# EasyEDA Pro project LEDChaser_PCB2_2025-11-05.epro

# Board PCB2
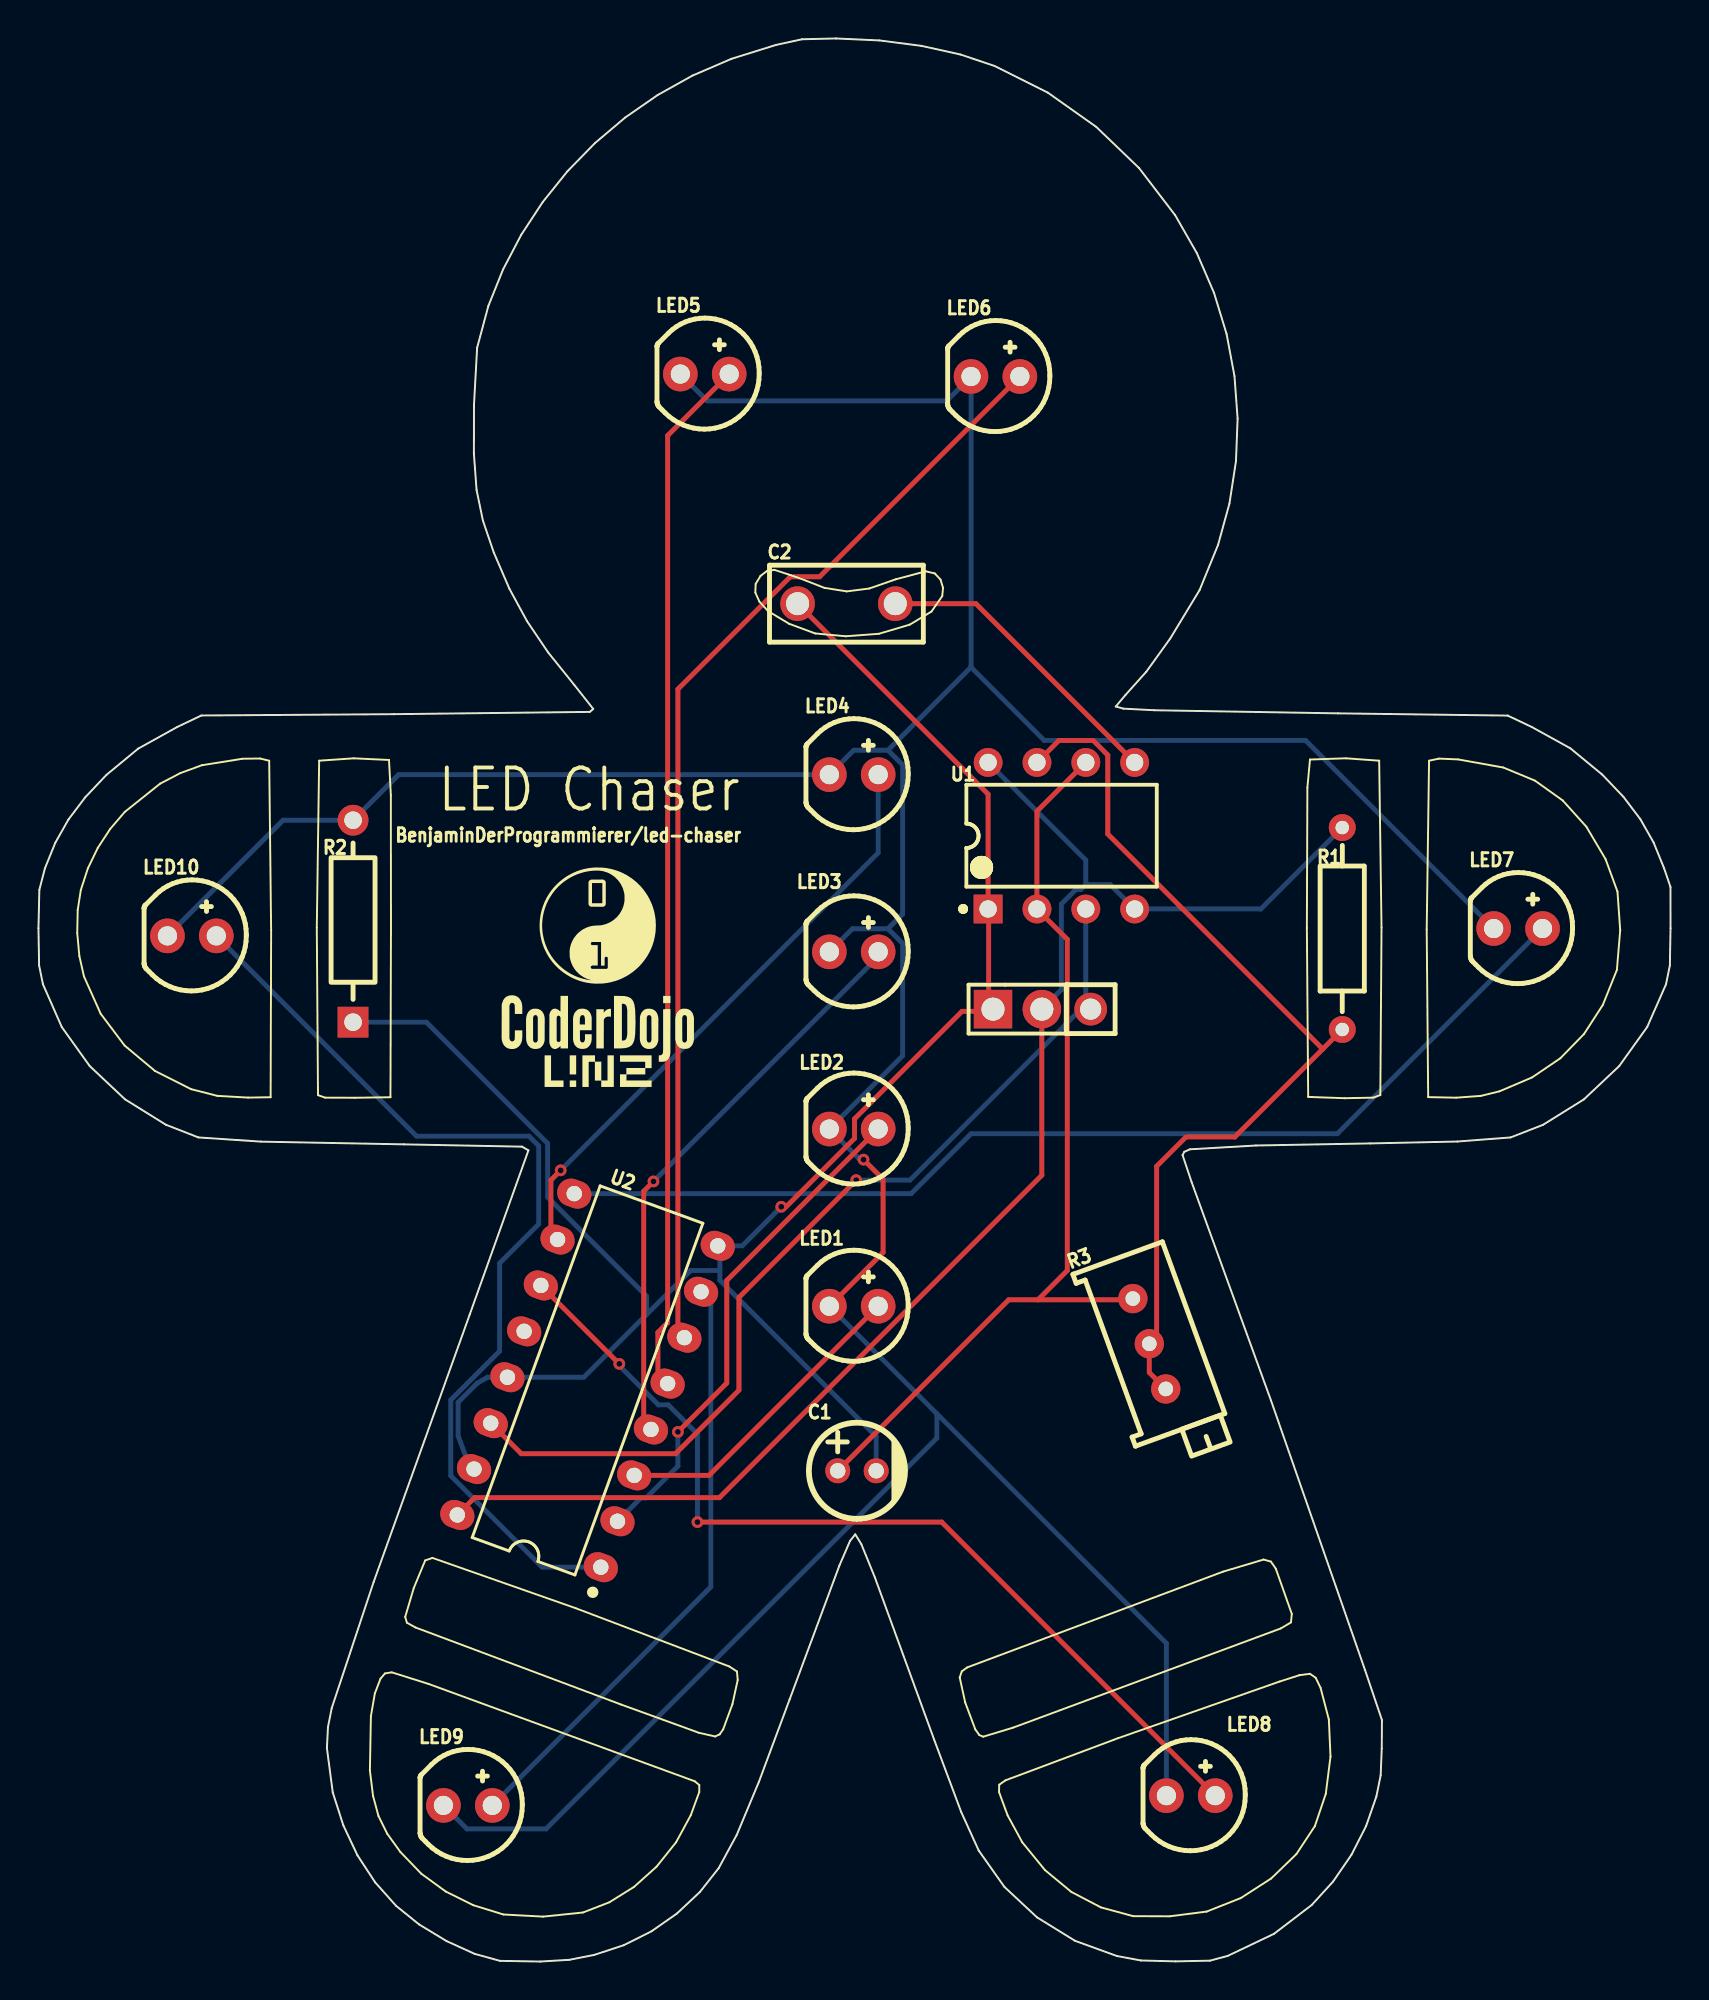
[diagram p0: board, top side]
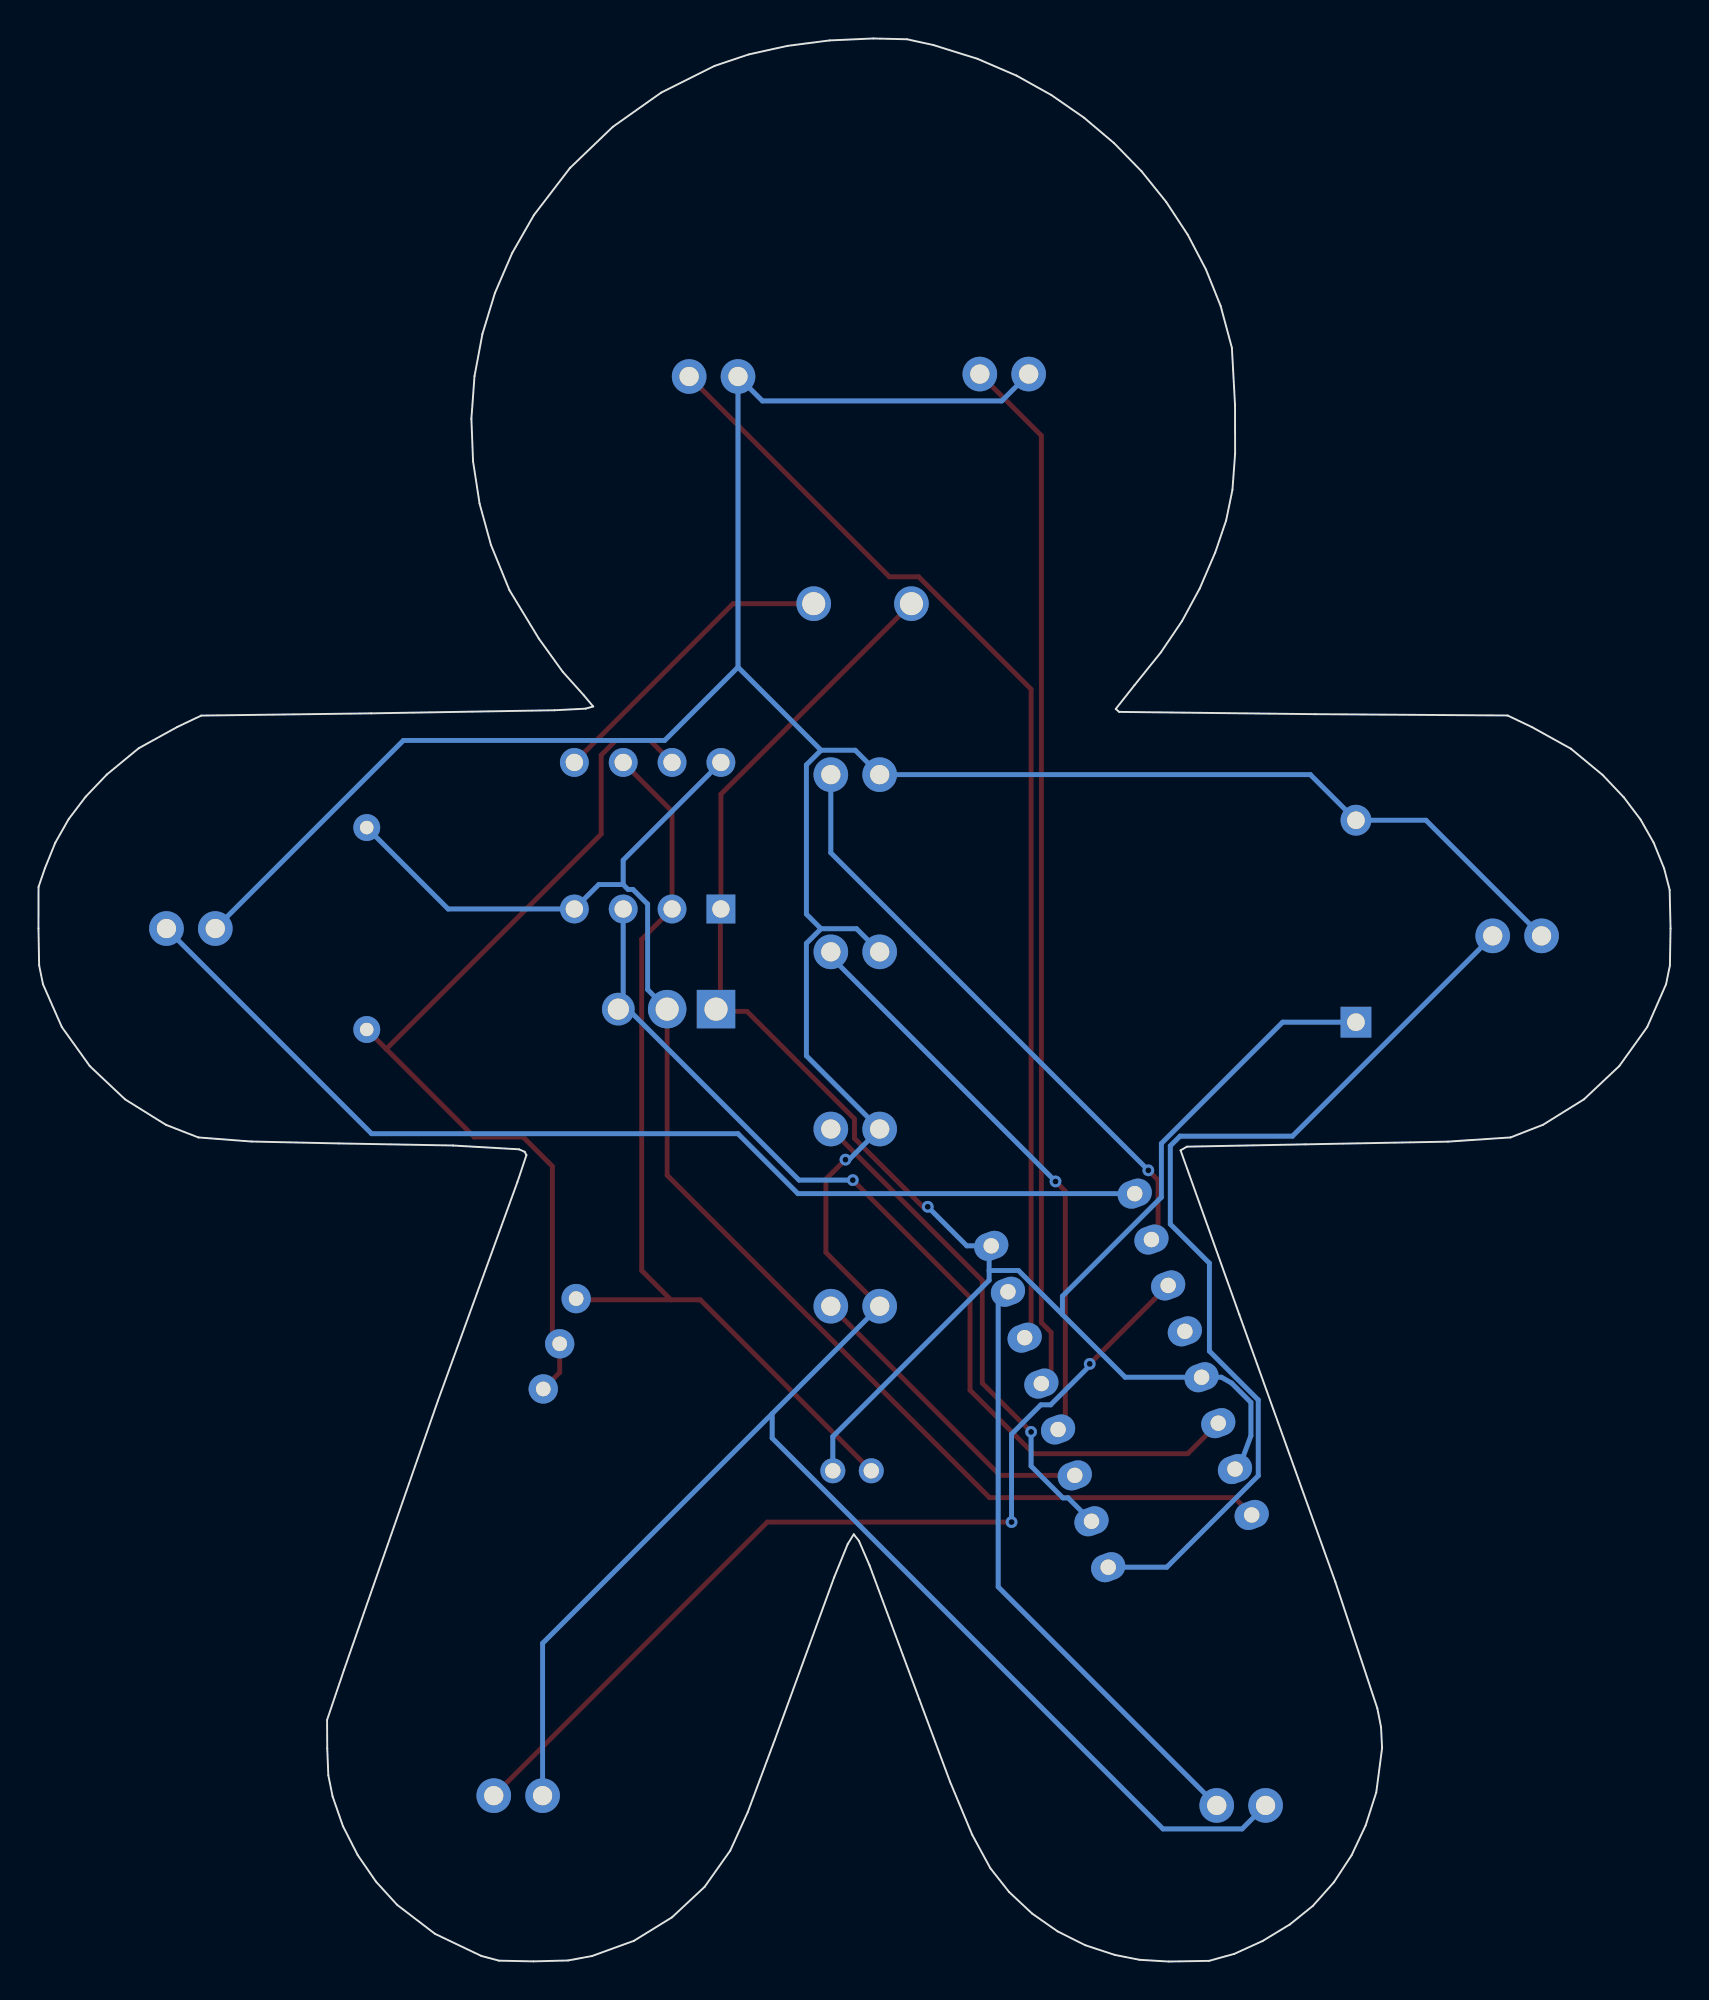
[diagram p1: board, bottom side, seen from below]

Outline 84.86 x 99.99 mm; copper layers: Top Layer, Bottom Layer. Coordinates in mm from the lower left corner of the outline.
Outline path: 0,53.72 0.05,55.72 0.34,56.84 0.87,58.17 1.56,59.38 2.43,60.54 3.54,61.7 5.19,63.07 7.21,64.19 8.47,64.79 18.48,64.86 28.67,64.97 28.85,65.13 27.86,66.37 26.51,68.06 25.4,69.69 24.48,71.39 23.68,73.26 23.11,74.93 22.78,76.52 22.64,78.41 22.65,80.93 22.81,83.91 23.39,86.08 24.16,87.98 25.1,89.78 26.22,91.49 27.5,93.08 28.93,94.55 30.5,95.87 32.2,97.05 34.01,98.06 36.03,98.93 38.35,99.65 39.7,99.95 41.46,99.99 43.72,99.89 45.9,99.6 47.93,99.16 49.71,98.56 52.48,97.17 55,95.39 57.23,93.25 59.1,90.8 60.23,88.83 61.13,86.76 61.78,84.62 62.19,82.43 62.35,80.22 62.27,78 61.93,75.81 61.33,73.65 60.38,71.31 58.85,68.79 57.61,67.07 56.51,65.85 56.02,65.26 56.41,65.14 58.03,65.06 67.56,64.9 76.39,64.78 77.65,64.19 79.65,63.08 81.31,61.72 82.41,60.56 83.29,59.4 83.98,58.18 84.53,56.84 84.86,55.87 84.86,53.72 84.83,51.8 84.63,50.81 83.65,48.59 82.19,46.56 80.36,44.83 78.24,43.51 76.55,42.85 73.78,42.64 69.25,42.54 63.31,42.43 59.87,42.23 59.58,42.1 59.49,41.93 59.96,40.53 64.09,29.16 68.97,15.16 69.86,12.56 69.85,11.08 69.79,9.68 69.57,8.59 69.03,7.04 68.27,5.54 67.31,4.16 66.21,2.94 64.24,1.44 61.84,0.29 60.91,0.05 59.13,0.01 57.32,0.06 56.08,0.29 53.9,1.08 51.92,2.29 50.23,3.88 48.89,5.77 47.98,7.77 46.57,11.54 43.49,19.97 42.78,21.71 42.47,22.21 42.2,21.87 41.65,20.59 39.06,13.63 37.46,9.34 36.31,6.59 35.37,4.85 34.39,3.62 33.2,2.5 31.87,1.57 30.43,0.85 28.9,0.35 27.61,0.09 26.09,0 24,0.04 22.68,0.4 21.22,1.06 19.79,1.93 18.6,2.89 17.51,4.12 16.59,5.52 15.85,7.08 15.3,8.79 15,11.1 15.05,12.19 15.25,13.17 17.43,19.73 22.42,33.63 25.48,42.18 25.14,42.37 18.99,42.49 11.57,42.63 8.32,42.85 6.63,43.51 4.5,44.83 2.67,46.56 1.21,48.59 0.23,50.81 0.03,51.79 0,53.72
Stack: Top Layer 0.035mm / Dielectric1 1.51mm FR4 er 4.5 / Bottom Layer 0.035mm

## Design rules (mm)
template: JLCPCB Capability(Two Layers Board)
spacing copperThickness1oz (default): track to track 0.102, other pairs 0.152 to 0.3
spacing copperThickness2oz: track to track 0.203, other pairs 0.152 to 0.3
track width copperThickness1oz (default): min 0.127, default 0.254, max 2.54
track width copperThickness2oz: min 0.203, default 0.254, max 2.54
differential pair differentialPair (default): width min 0.127, default 0.254, max 2.54; gap min 0.152, default 0.152
via viaSize (default): diameter min 0.5, default 0.61, max 10; hole min 0.3, default 0.305, max 6.3

## Placement (name value [footprint] x y rotation side)
C1  1uF  [CAP-TH_BD5.0-P2.00-D0.8-FD]  42.56 25.52 0 top
C2  10nF  [CAP-TH_L8.0-W4.0-P5.00-D1.2]  42.01 70.6 0 top
H1  GND VCC  [HDR-TH_2P-P2.54-V-M]  50.9 49.52 0 top
LED1  XL-502UWC  [LED-TH_BD5.9-P2.54-RD_WHITE]  42.39 34.07 0 top
LED2  XL-502UWC  [LED-TH_BD5.9-P2.54-RD_WHITE]  42.39 43.29 0 top
LED3  XL-502UWC  [LED-TH_BD5.9-P2.54-RD_WHITE]  42.39 52.5 0 top
LED4  XL-502UWC  [LED-TH_BD5.9-P2.54-RD_WHITE]  42.39 61.71 0 top
LED5  XL-502UWC  [LED-TH_BD5.9-P2.54-RD_WHITE]  34.65 82.54 0 top
LED6  XL-502UWC  [LED-TH_BD5.9-P2.54-RD_WHITE]  49.76 82.41 0 top
LED7  XL-502UWC  [LED-TH_BD5.9-P2.54-RD_WHITE]  76.94 53.71 0 top
LED8  XL-502UWC  [LED-TH_BD5.9-P2.54-RD_WHITE]  59.92 8.63 0 top
LED9  XL-502UWC  [LED-TH_BD5.9-P2.54-RD_WHITE]  22.33 8.12 0 top
LED10  XL-502UWC  [LED-TH_BD5.9-P2.54-RD_WHITE]  7.98 53.33 0 top
P1  CLK  [HDR-TH_1P-P2.54-V-M]  54.71 49.52 0 top
R1  1kΩ  [RES-TH_BD2.3-L6.5-P10.50-D0.5]  67.79 53.71 90 top
R2  470Ω  [RES-TH_BD2.2-L6.5-P10.50-D0.6]  16.36 54.09 90 top
R3  50kΩ  [RES-ADJ-TH_3P-L9.5-W4.85-P2.50-BL-L]  57.76 32.12 20 top
U1  NE555P  [DIP-8_L9.8-W6.6-P2.54-LS7.6-BL]  53.19 58.54 0 top
U2  CD4017BE(LX)  [PDIP-16_L19.3-W6.4-P2.54-LS7.94-BL]  28.55 30.22 70 top

## Footprints (pads in the part's own frame, mm; a bottom-side part is the same pattern mirrored in y, then rotated)
CAP-TH_BD5.0-P2.00-D0.8-FD
  round 1.3 hole 0.8: 1(-1,0) 2(1,0)
CAP-TH_L8.0-W4.0-P5.00-D1.2
  round 1.8 hole 1.2: 1(-2.54,0) 2(2.54,0)
DIP-8_L9.8-W6.6-P2.54-LS7.6-BL
  rect 1.5x1.5 hole 0.9: 1(-3.81,-3.81)
  round 1.5 hole 0.9: 2(-1.27,-3.81) 3(1.27,-3.81) 4(3.81,-3.81) 5(3.81,3.81) 6(1.27,3.81) 7(-1.27,3.81) 8(-3.81,3.81)
HDR-TH_1P-P2.54-V-M
  round 1.7 hole 1.1: 1(0,0)
HDR-TH_2P-P2.54-V-M
  rect 2x2 hole 1.2: 1(-1.27,0)
  round 2 hole 1.2: 2(1.27,0)
LED-TH_BD5.9-P2.54-RD_WHITE
  round 1.8 hole 1: 1(-1.27,0) 2(1.27,0)
PDIP-16_L19.3-W6.4-P2.54-LS7.94-BL
  oval 1.44x1.8 hole 0.8: 1(-8.89,-3.97) 2(-6.35,-3.97) 3(-3.81,-3.97) 4(-1.27,-3.97) 5(1.27,-3.97) 6(3.81,-3.97) 7(6.35,-3.97) 8(8.89,-3.97) 9(8.89,3.97) 10(6.35,3.97) 11(3.81,3.97) 12(1.27,3.97) 13(-1.27,3.97) 14(-3.81,3.97) 15(-6.35,3.97) 16(-8.89,3.97)
RES-ADJ-TH_3P-L9.5-W4.85-P2.50-BL-L
  round 1.524 hole 0.762: 1(0,2.5) 2(0,0) 3(0,-2.5)
RES-TH_BD2.2-L6.5-P10.50-D0.6
  rect 1.6x1.6 hole 0.914: 1(-5.25,0)
  round 1.6 hole 0.914: 2(5.25,0)
RES-TH_BD2.3-L6.5-P10.50-D0.5
  round 1.4 hole 0.7: 1(-5.25,0) 2(5.25,0)

## Nets
GND: C1.2 C2.1 H1.1 R2.1 U1.1 U2.8 U2.13 U2.15
VCC: H1.2 R1.2 U1.4 U1.8 U2.16
CLOCK: P1.1 U1.3 U2.14
$1N3080: LED1.1 LED2.1 LED3.1 LED4.1 LED5.1 LED6.1 LED7.1 LED8.1 LED9.1 LED10.1 R2.2
$1N3345: LED1.2 U2.3
$1N3351: LED2.2 U2.2
$1N3358: LED3.2 U2.4
$1N3365: LED9.2 U2.7
$1N3403: LED8.2 U2.11
$1N3409: LED7.2 U2.9
$1N3416: LED6.2 U2.6
$1N3423: LED5.2 U2.5
$1N3480: LED10.2 U2.1
$1N3486: LED4.2 U2.10
$1N3535: C1.1 R3.1 U1.2 U1.6
$1N3606: R1.1 R3.2 R3.3 U1.7
$1N3725: C2.2 U1.5

Pads without a net: U2 12

## Via types
v1: diameter 0.61, hole 0.305, Top Layer to Bottom Layer, 8 vias

## Routing (per net, layer and track width the routed paths; a pad name or vN(x,y) marks a point on that pad's centre or on a via; arc(x,y) is an arc through that point)
GND: length 104.2
  Top Layer w0.254: 49.41,49.52 H1.1 ; 49.41,49.52 49.29,49.4 48.02,49.4 42.43,43.82 42.43,42.8 38.88,39.24 v1(38.62,39.24) ; 49.41,49.52 49.41,54.7 49.38,54.73 49.38,60.7 C2.1
  Bottom Layer w0.254: C1.2 43.56,27.29 35.43,35.42 35.43,35.93 ; R2.1 20.17,48.84 26.48,42.53 26.48,39.74 31.62,34.59 31.62,33.64 ; v1(38.62,39.24) 36.59,37.21 35.32,37.21 35.43,37.1 35.43,35.93 ; 31.62,33.64 33.91,35.93 35.43,35.93 ; 31.62,33.64 28.36,30.38 23.35,30.38 22.82,30.08 21.82,29.07 21.82,27.34 22.35,25.9 U2.15
VCC: length 78
  Top Layer w0.254: H1.2 52.17,40.88 35.41,24.12 22.68,24.12 21.78,23.22
  Bottom Layer w0.254: 54.46,56 55.73,56 57,54.73 63.56,54.73 R1.2 ; 54.46,56 54.46,57.27 U1.8 ; 54.46,56 54.2,55.74 53.95,55.74 53.19,54.98 53.19,50.54 H1.2
CLOCK: length 49.4
  Top Layer w0.254: v1(42.52,40.63) 36.42,34.53 36.42,29.71 33.12,26.41 25.1,26.41 U2.14
  Bottom Layer w0.254: 54.46,49.77 45.31,40.63 v1(42.52,40.63) ; 54.46,49.77 P1.1 ; 54.46,49.77 54.46,54.73
$1N3080: length 217.7
  Top Layer w0.254: LED1.1 43.92,36.87 43.92,40.68 v1(42.9,41.69)
  Bottom Layer w0.254: 44.17,53.7 44.93,52.94 44.93,47.1 LED2.1 42.72,41.69 v1(42.9,41.69) ; 44.17,53.7 44.93,54.46 44.93,62.22 44.17,62.98 ; 44.17,53.7 42.32,53.7 LED3.1 ; LED8.1 58.65,16.55 46.71,28.49 ; 44.17,62.98 48.49,67.3 ; 44.17,62.98 42.39,62.98 LED4.1 18.73,61.71 R2.2 12.72,59.34 LED10.1 ; 48.49,67.3 52.3,63.49 65.89,63.49 75.67,53.71 ; 48.49,67.3 LED6.1 47.22,81.14 34.77,81.14 LED5.1 ; 46.71,28.49 LED1.1 ; 46.71,28.49 46.71,27.22 26.39,6.9 22.28,6.9 LED9.1
$1N3345: length 16.3
  Top Layer w0.254: U2.3 34.87,25.28 LED1.2
$1N3351: length 26.2
  Top Layer w0.254: LED2.2 35.79,35.41 35.79,30.08 v1(33.25,27.54)
  Bottom Layer w0.254: U2.2 31.33,24.11 31.6,24.11 33.25,25.76 v1(33.25,27.54)
$1N3358: length 30
  Top Layer w0.254: U2.4 31.47,28.04 31.47,40.05 v1(31.98,40.56)
  Bottom Layer w0.254: v1(31.98,40.56) 43.66,52.24 LED3.2
$1N3365: length 31.6
  Bottom Layer w0.254: 34.45,34.82 34.96,34.32 34.96,19.48 23.6,8.12
$1N3403: length 48.8
  Top Layer w0.254: v1(30.2,31.08) U2.11 ; LED8.2 46.97,22.85 v1(34.27,22.85)
  Bottom Layer w0.254: v1(34.27,22.85) 34.27,27.42 32.74,28.95 32.23,28.95 30.2,30.98 v1(30.2,31.08)
$1N3409: length 56.1
  Bottom Layer w0.254: U2.9 45.37,39.93 48.49,43.04 67.54,43.04 LED7.2
$1N3416: length 58.4
  Top Layer w0.254: LED6.2 40.61,72 39.09,72 33.25,66.16 33.25,32.77 U2.6
$1N3423: length 54.2
  Top Layer w0.254: 32.72,30.05 32.21,30.56 32.21,32.71 32.72,33.22 32.72,79.34 LED5.2
$1N3480: length 50.1
  Bottom Layer w0.254: LED10.2 19.66,42.92 25.5,42.92 26.01,42.41 26.01,38.34 23.98,36.31 23.98,31.74 21.44,29.2 21.44,25.26 26.19,20.5 U2.1
$1N3486: length 31.4
  Top Layer w0.254: v1(27.15,41.14) 26.64,40.63 26.64,37.89 U2.10
  Bottom Layer w0.254: v1(27.15,41.14) 43.66,57.65 LED4.2
$1N3535: length 49.3
  Top Layer w0.254: U1.6 51.92,59.81 51.92,54.73 53.5,53.15 53.5,35.93 51.97,34.41 ; 51.97,34.41 50.45,34.41 C1.1 ; 51.97,34.41 56.84,34.41 R3.1
$1N3606: length 49.1
  Top Layer w0.254: U1.7 53.06,63.49 54.84,63.49 55.6,62.73 55.6,58.62 66.78,47.44 ; 66.78,47.44 R1.1 ; 66.78,47.44 62.2,42.87 59.67,42.87 58.14,41.35 58.14,32.5 R3.2 57.76,30.63 R3.3
$1N3725: length 15.9
  Top Layer w0.254: C2.2 48.74,70.6 U1.5

## Text on the board
Top Silkscreen Layer: BenjaminDerProgrammierer/led-chaser | LED Chaser
